# Altium schematic sheet sch.SchDoc
size A4
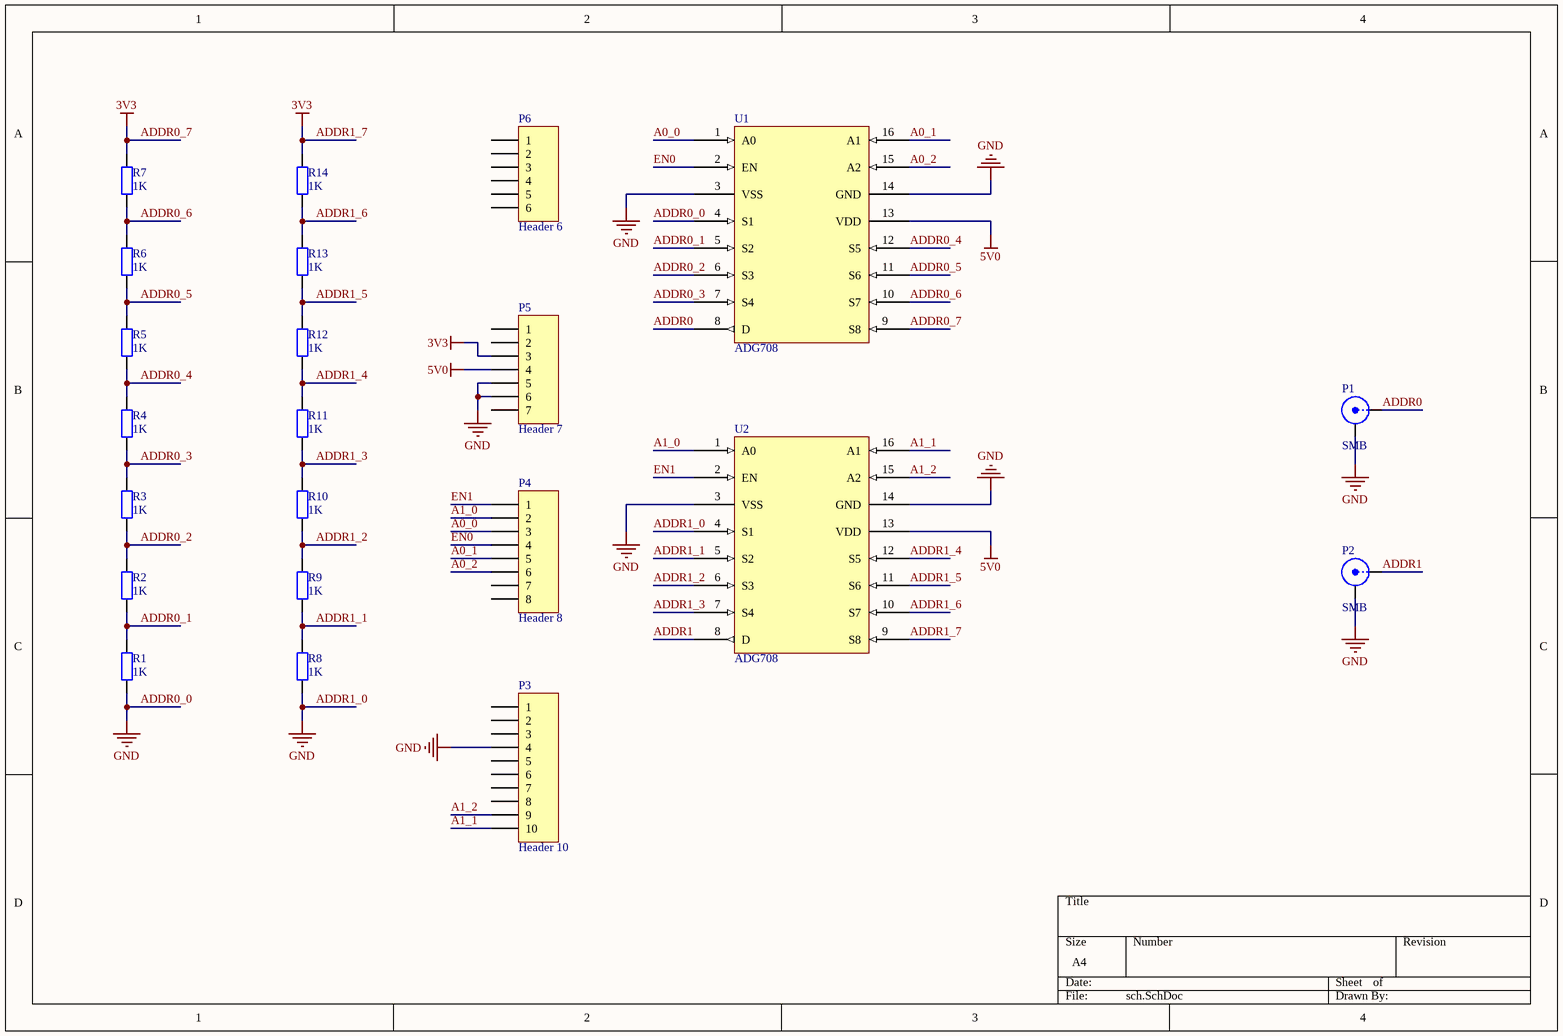
[diagram p0: sch.SchDoc]

## Parts
P1  SMB  [SMB_V-RJ45]
P2  SMB  [SMB_V-RJ45]
P3  Header 10  [HDR1X10]
P4  Header 8  [HDR1X8]
P5  Header 7  [HDR1X7]
P6  Header 6  [HDR1X6]
R1  value 1K  [0805R]  (hidden comment: Res2)
R2  value 1K  [0805R]  (hidden comment: Res2)
R3  value 1K  [0805R]  (hidden comment: Res2)
R4  value 1K  [0805R]  (hidden comment: Res2)
R5  value 1K  [0805R]  (hidden comment: Res2)
R6  value 1K  [0805R]  (hidden comment: Res2)
R7  value 1K  [0805R]  (hidden comment: Res2)
R8  value 1K  [0805R]  (hidden comment: Res2)
R9  value 1K  [0805R]  (hidden comment: Res2)
R10  value 1K  [0805R]  (hidden comment: Res2)
R11  value 1K  [0805R]  (hidden comment: Res2)
R12  value 1K  [0805R]  (hidden comment: Res2)
R13  value 1K  [0805R]  (hidden comment: Res2)
R14  value 1K  [0805R]  (hidden comment: Res2)
U1  ADG708  [TSSOP16]
U2  ADG708  [TSSOP16]

## Nets
5V0: P5.4 U1.13(VDD) U2.13(VDD)
ADDR0_0: P1.2(Y) P2.2(Y) P3.4 P5.5 P5.6 R1.1 R8.1 U1.3(VSS) U1.4(S1) U1.14(GND) U2.3(VSS) U2.4(S1) U2.14(GND)  [also labelled ADDR1_0, GND]
ADDR0_7: P5.3 R7.2 R14.2 U1.9(S8) U2.9(S8)  [also labelled 3V3, ADDR1_7]
A0_0: P4.3 U1.1(A0)
A0_1: P4.5 U1.16(A1)
A0_2: P4.6 U1.15(A2)
A1_0: P4.2 U2.1(A0)
A1_1: P3.10 U2.16(A1)
A1_2: P3.9 U2.15(A2)
ADDR0: P1.1(X) U1.8(D)
ADDR0_1: R1.2 R2.1 U1.5(S2)
ADDR0_2: R2.2 R3.1 U1.6(S3)
ADDR0_3: R3.2 R4.1 U1.7(S4)
ADDR0_4: R4.2 R5.1 U1.12(S5)
ADDR0_5: R5.2 R6.1 U1.11(S6)
ADDR0_6: R6.2 R7.1 U1.10(S7)
ADDR1: P2.1(X) U2.8(D)
ADDR1_1: R8.2 R9.1 U2.5(S2)
ADDR1_2: R9.2 R10.1 U2.6(S3)
ADDR1_3: R10.2 R11.1 U2.7(S4)
ADDR1_4: R11.2 R12.1 U2.12(S5)
ADDR1_5: R12.2 R13.1 U2.11(S6)
ADDR1_6: R13.2 R14.1 U2.10(S7)
EN0: P4.4 U1.2(EN)
EN1: P4.1 U2.2(EN)

Not connected (* = marked no-connect by the designer): P3 1 2 3 5 6 7 8; P4 7 8; P5 1 2 7; P6 1 2 3 4 5 6

## Library data of the parts
P1 P2 = SMB: SMB Straight Connector; LatestRevisionDate: 17-Jul-2002; LatestRevisionNote: Re-released for DXP Platform.; Publisher: Altium Limited
P3 = Header 10: Header, 10-Pin; LatestRevisionDate: 17-Jul-2002; LatestRevisionNote: Re-released for DXP Platform.; Publisher: Altium Limited
P4 = Header 8: Header, 8-Pin; LatestRevisionDate: 17-Jul-2002; LatestRevisionNote: Re-released for DXP Platform.; Publisher: Altium Limited
P5 = Header 7: Header, 7-Pin; LatestRevisionDate: 17-Jul-2002; LatestRevisionNote: Re-released for DXP Platform.; Publisher: Altium Limited
P6 = Header 6: Header, 6-Pin; LatestRevisionDate: 17-Jul-2002; LatestRevisionNote: Re-released for DXP Platform.; Publisher: Altium Limited
R1-R14 = Res2: Resistor; Published: 8-Jun-2000; LatestRevisionDate: 17-Jul-2002; LatestRevisionNote: Re-released for DXP Platform.; PackageReference: AXIAL-0.4; Publisher: Altium Limited; PackageDescription: Axial Device, Thru-Hole; 2 Leads; 0.4 in Pin Spacing